# Altium schematic sheet ethernet.SchDoc: Edison Breakout
size Letter; Author: Ye-Sheng Kuo; Revision: 1; SheetTotal: 9
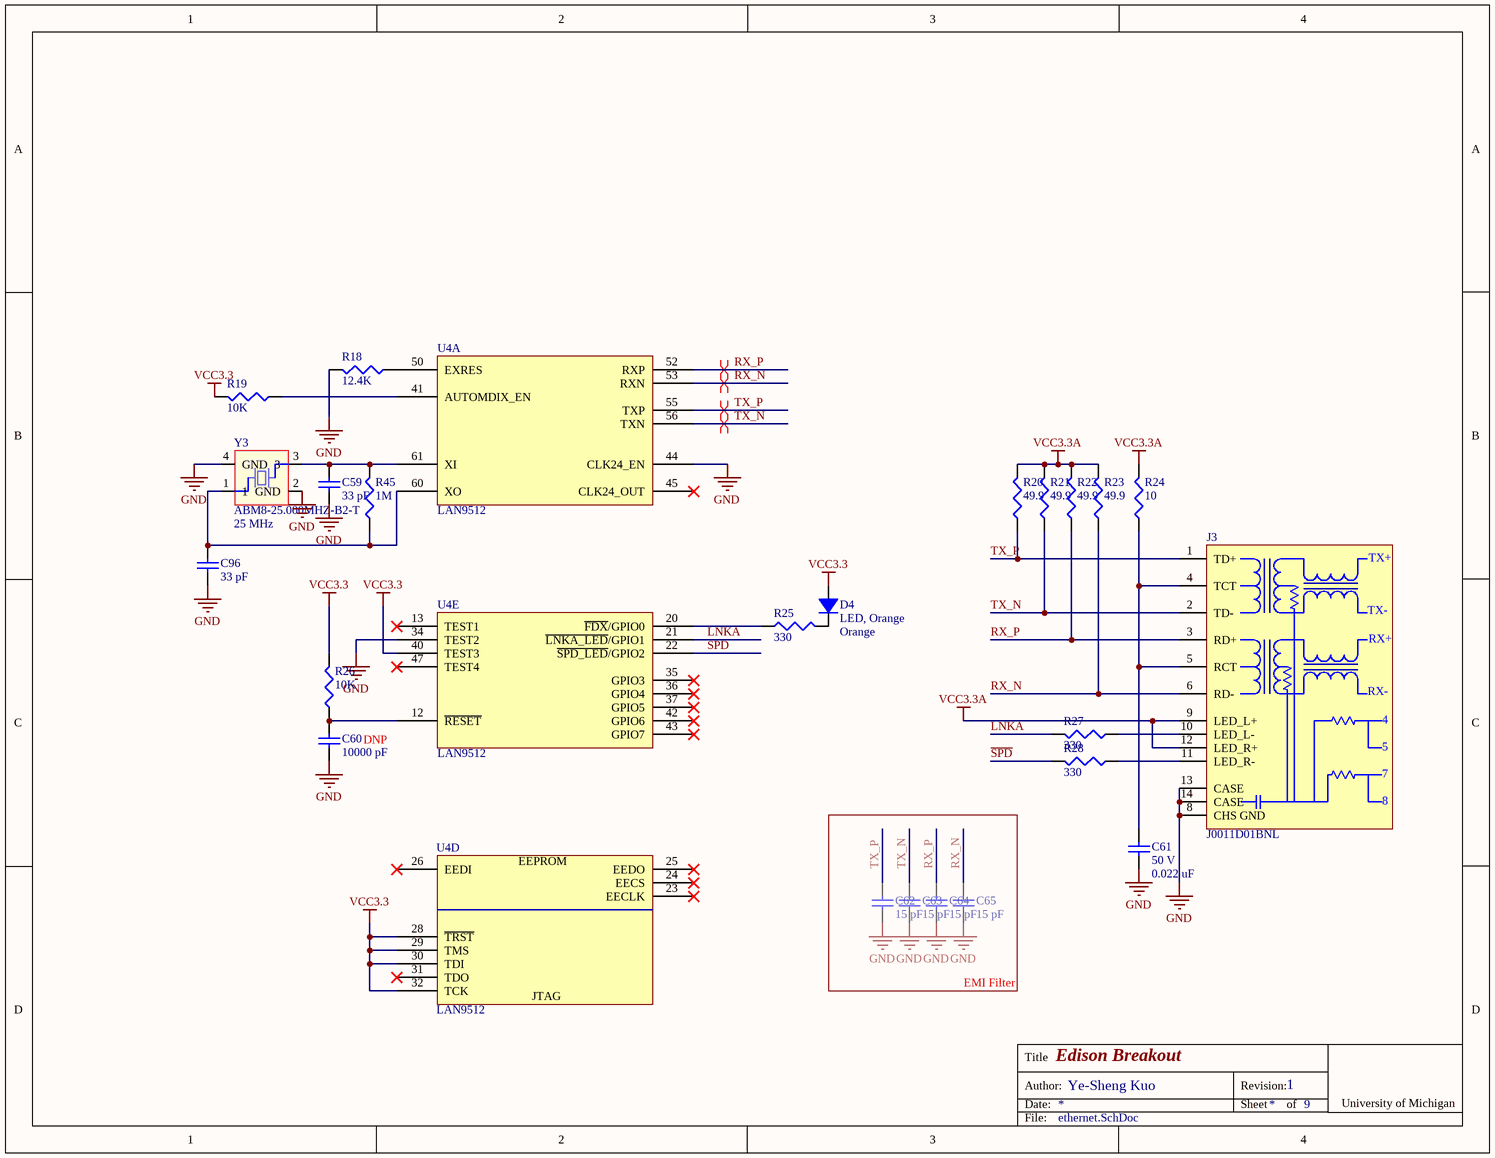
[diagram p0: ethernet.SchDoc]

## Parts
C59  value 33 pF  [0402]  (hidden comment: Ceramic capacitor)
C60  value 10000 pF  [0402]  (hidden comment: Ceramic capacitor)
C61  value 0.022 uF  voltage rated: 50 V  [0402]  (hidden comment: Ceramic capacitor)
C62  value 15 pF  [0402]  (hidden comment: Ceramic capacitor)
C63  value 15 pF  [0402]  (hidden comment: Ceramic capacitor)
C64  value 15 pF  [0402]  (hidden comment: Ceramic capacitor)
C65  value 15 pF  [0402]  (hidden comment: Ceramic capacitor)
C96  value 33 pF  [0402]  (hidden comment: Ceramic capacitor)
D4  LED, Orange  Color: Orange  [0402 - DIODE]
J3  J0011D01BNL  [J0011D01BNL]
R18  value 12.4K  [0402]  (hidden comment: Chip resistor)
R19  value 10K  [0402]  (hidden comment: Chip resistor)
R20  value 49.9  [0402]  (hidden comment: Chip resistor)
R21  value 49.9  [0402]  (hidden comment: Chip resistor)
R22  value 49.9  [0402]  (hidden comment: Chip resistor)
R23  value 49.9  [0402]  (hidden comment: Chip resistor)
R24  value 10  [0402]  (hidden comment: Chip resistor)
R25  value 330  [0402]  (hidden comment: Chip resistor)
R26  value 10K  [0402]  (hidden comment: Chip resistor)
R27  value 330  [0402]  (hidden comment: Chip resistor)
R28  value 330  [0402]  (hidden comment: Chip resistor)
R45  value 1M  [0402]  (hidden comment: Chip resistor)
U4  LAN9512  [QFN-64]  (parts A,D,E of 5)
Y3  ABM8-25.000MHZ-B2-T  Frequency: 25 MHz  [ABM8]

## Blocks framed on the sheet
EMI Filter: C62-C65

## Nets
GND: C59.2 C60.2 C61.2 C62.2 C63.2 C64.2 C65.2 C96.2 J3.8(CHS_GND) J3.13(CASE) J3.14(CASE) R18.1 U4.34(TEST2) U4.44(CLK24_EN) Y3.2(GND) Y3.4(GND)
VCC3.3: D4.1 R19.1 R26.1 U4.28(~{TRST}) U4.29(TMS) U4.30(TDI) U4.32(TCK) U4.40(TEST3)
VCC3.3A: J3.9(LED_L+) J3.12(LED_R+) R20.1 R21.1 R22.1 R23.1 R24.1
~{LNKA}: R27.1 U4.21(~{LNKA_LED}/GPIO1)
RX_N: C65.1 J3.6(RD-) R23.2 U4.53(RXN)
RX_P: C64.1 J3.3(RD+) R22.2 U4.52(RXP)
~{SPD}: R28.1 U4.22(~{SPD_LED}/GPIO2)
TX_N: C63.1 J3.2(TD-) R21.2 U4.56(TXN)
TX_P: C62.1 J3.1(TD+) R20.2 U4.55(TXP)
NetC59_1: C59.1 R45.1 U4.61(XI) Y3.3
NetC60_1: C60.1 R26.2 U4.12(~{RESET})
NetC61_1: C61.1 J3.4(TCT) J3.5(RCT) R24.2
NetC96_1: C96.1 R45.2 U4.60(XO) Y3.1
NetD4_2: D4.2 R25.1
NetJ3_10: J3.10(LED_L-) R27.2
NetJ3_11: J3.11(LED_R-) R28.2
NetR18_2: R18.2 U4.50(EXRES)
NetR19_2: R19.2 U4.41(AUTOMDIX_EN)
NetR25_2: R25.2 U4.20(~{FDX}/GPIO0)

Not connected (* = marked no-connect by the designer): U4 13(TEST1)* 23(EECLK)* 24(EECS)* 25(EEDO)* 26(EEDI)* 31(TDO)* 35(GPIO3)* 36(GPIO4)* 37(GPIO5)* 42(GPIO6)* 43(GPIO7)* 45(CLK24_OUT)* 47(TEST4)*

## Layout directives
differential pair: RX_N, RX_P, TX_N, TX_P

## Notes on the sheet
- DNP
- Title
- Date:
- Author:
- Revision:
- Sheet
- of
- University of Michigan
- File:
- (in symbol J0011D01BNL) TX+; TX-; RX+; RX-; 7
- (in symbol LAN9512, part D) EEPROM; JTAG

## Library data of the parts
C59 C96 = C_33p_0402_ceramic: Ceramic capacitor, 33 pF, 0402 package; Manufacture: Murata; voltage rated: 50 V; tolerance: 5%; package: 0402; Supplier 1: Digi-Key; Supplier Part Number 1: 490-5936-1-ND
C60 = C_10000p_16V_0402_ceramic: Ceramic capacitor, 10000 pF, 16 V, 0402 package; Manufacture: Murata; voltage rated: 16 V; tolerance: 10%; Temperature Coefficient: X7R; package: 0402; Supplier 1: Digi-Key; Supplier Part Number 1: 490-1313-1-ND
C61 = C_0.022u_50V_0402_ceramic: Ceramic capacitor, 0.022 uF, 0402 package; Manufacture: Murata; tolerance: 10%; Temperature Coefficient: X7R; package: 0402; Supplier 1: Digi-Key; Supplier Part Number 1: 490-3884-1-ND
C62-C65 = C_15p_25V_0402_ceramic: Ceramic capacitor, 15 pF, 25V, 0402 package; Manufacture: Murata; tolerance: 5%; voltage rated: 25 V; package: 0402; Supplier 1: Digi-Key; Supplier Part Number 1: 490-8171-1-ND
D4 = D_LED_ORANGE_0402: LED, Orange, 0402; Supplier 1: Digi-Key; Supplier Part Number 1: 511-1590-1-ND; package: 0402
J3 = J0011D01BNL: 1x1 Tab-Down RJ45; Supplier 1: Digi-Key; Supplier Part Number 1: 553-1483-ND
R18 = R_12.4K_0402: Chip resistor, 12.4K, 0402 package; tolerance: 1%; power: 1/16 W; package: 0402; Supplier 1: Digi-Key; Supplier Part Number 1: 311-12.4KLRCT-ND
R19 R26 = R_10K_0402: Chip resistor, 10K, 0402 package; tolerance: 1%; power: 1/16 W; package: 0402; Supplier 1: Digi-Key; Supplier Part Number 1: 541-10.0KLCT-ND
R20-R23 = R_49.9_0402: Chip resistor, 49.9, 0402 package; tolerance: 1%; power: 1/16 W; package: 0402; Supplier 1: Digi-Key; Supplier Part Number 1: 541-49.9LCT-ND
R24 = R_10_0402: Chip resistor, 10, 0402 package; tolerance: 1%; power: 1/16 W; package: 0402; Supplier 1: Digi-Key; Supplier Part Number 1: 541-10.0LCT-ND
R25 R27 R28 = R_330_0402: Chip resistor, 330, 0402 package; tolerance: 1%; power: 1/16 W; package: 0402; Supplier 1: Digi-Key; Supplier Part Number 1: 541-330LCT-ND
R45 = R_1M_0402: Chip resistor, 1M, 0402 package; tolerance: 1%; power: 1/16 W; Supplier 1: Digi-Key; Supplier Part Number 1: 541-1.00MLCT-ND; package: 0402
U4 = LAN9512: USB 2.0 Hub and 10/100  Ethernet Controller; Supplier 1: Digi-Key; Supplier Part Number 1: 638-1086-ND
Y3 = ABM8-25.000MHZ-B2-T: Crystal 25.0000MHz 20ppm 18pF 50 Ohm; Frequency stability: 50 ppm; ESR: 50 ohm; Load capacitance: 18 pF; Frequency tolerance: 20 ppm; Supplier 1: Digi-Key; Supplier Part Number 1: 535-9140-1-ND